# EAGLE schematic breakouts (EAGLE 6.5.0)
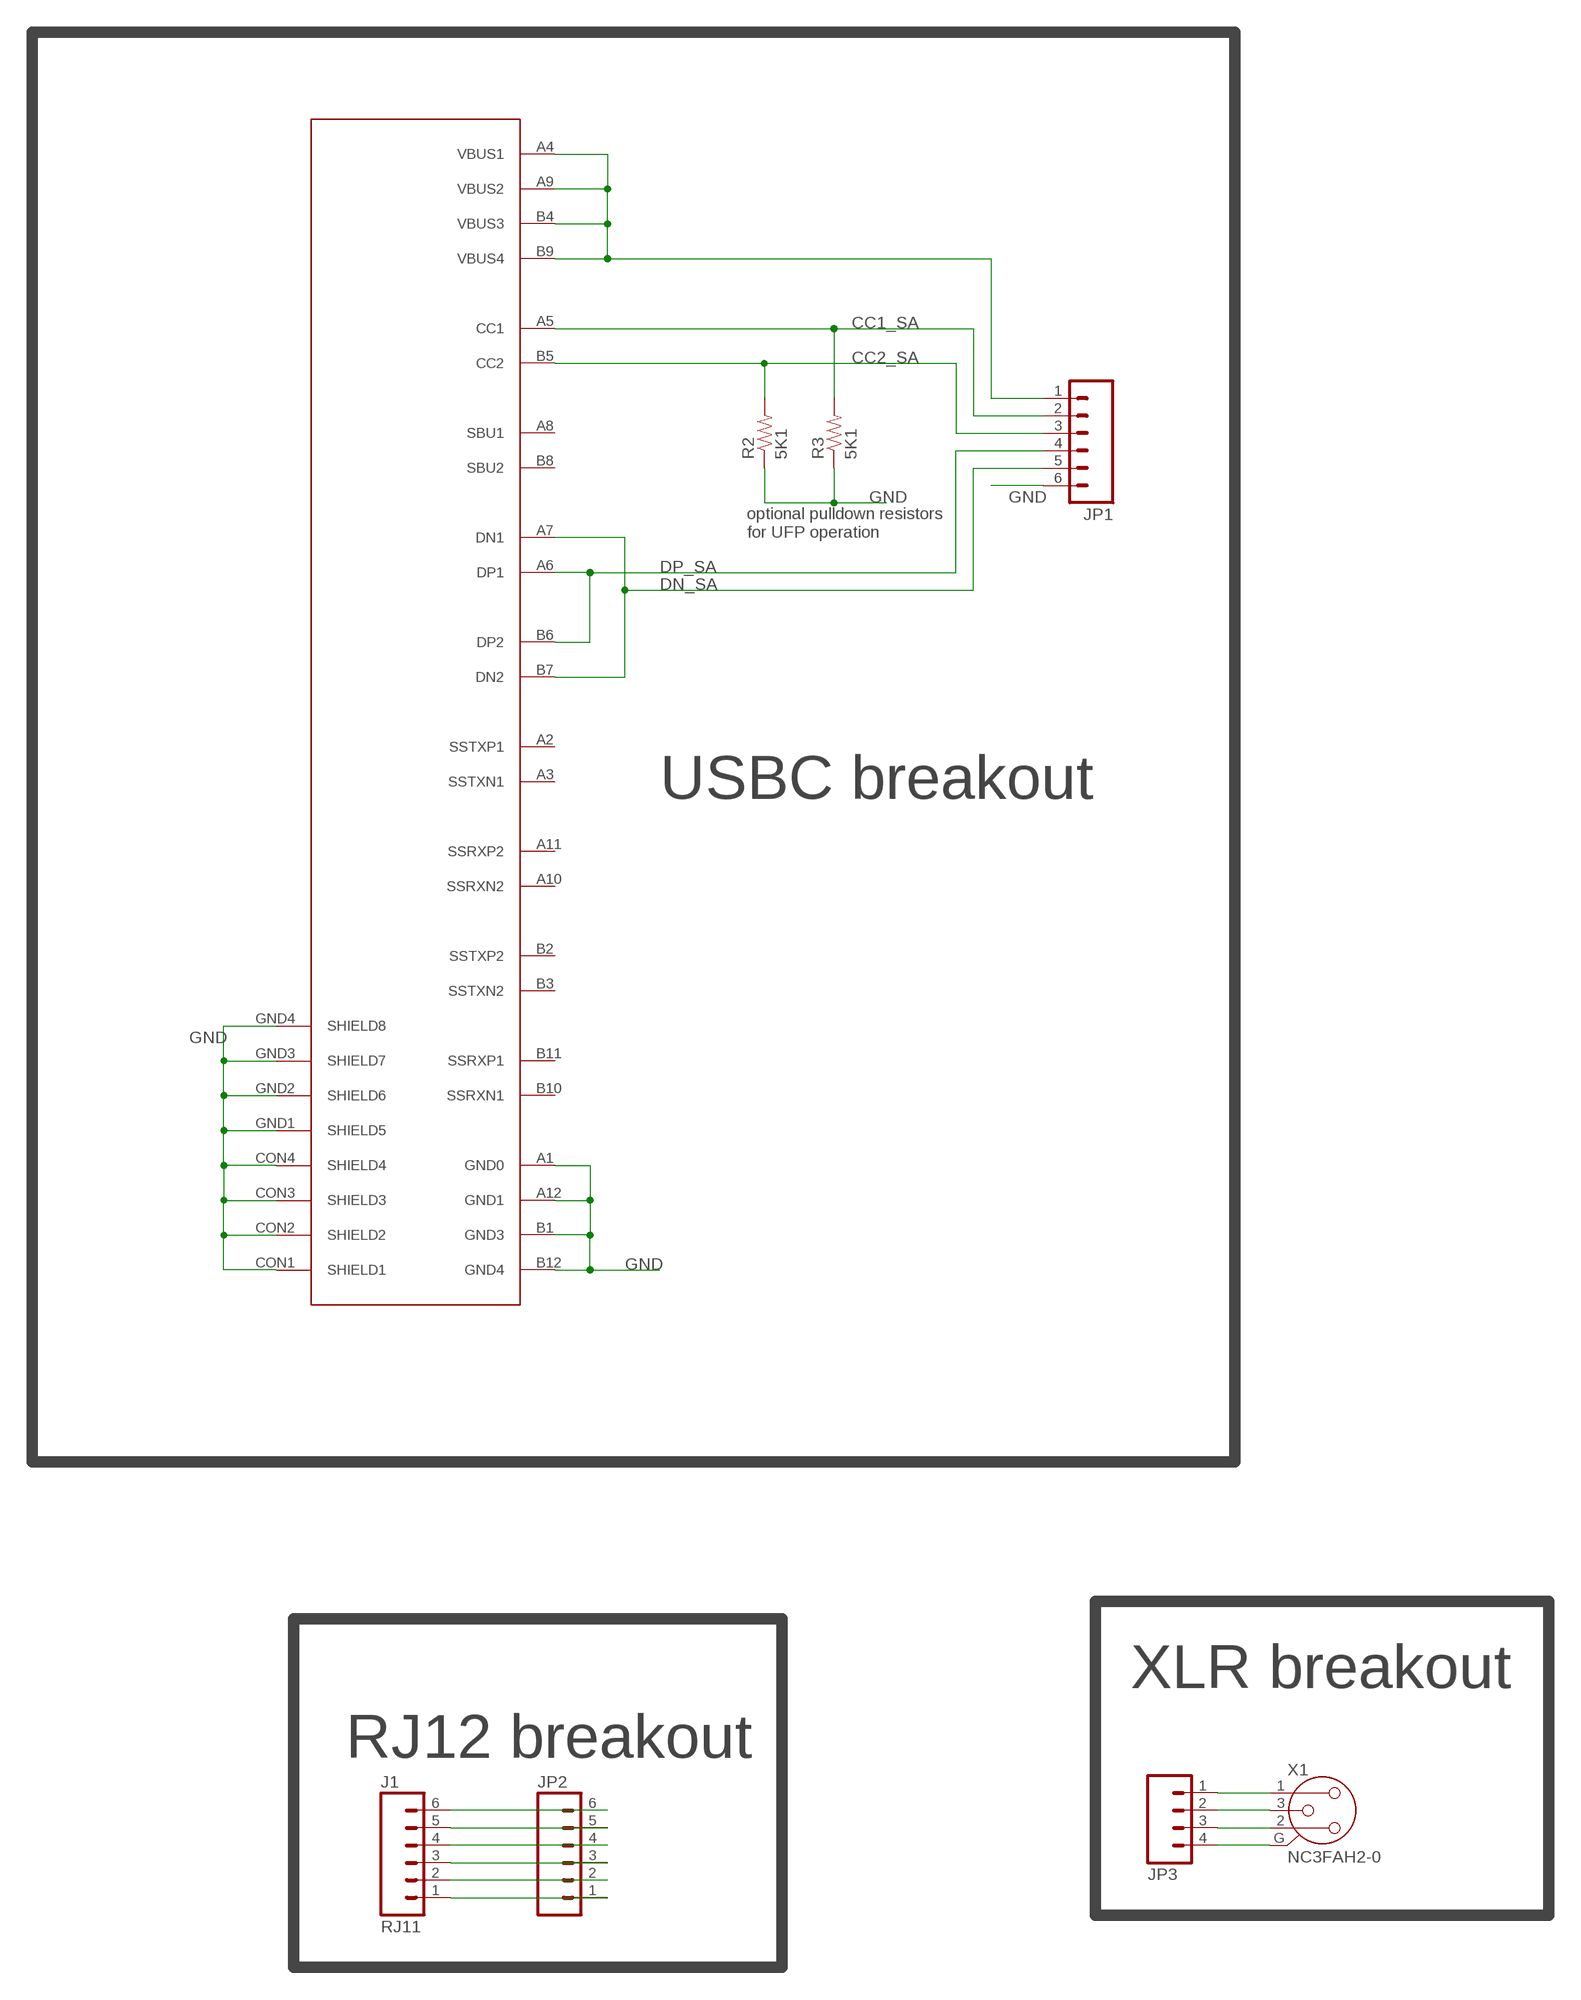
[diagram p0: schematic, sheet 1, part 1 of 2]
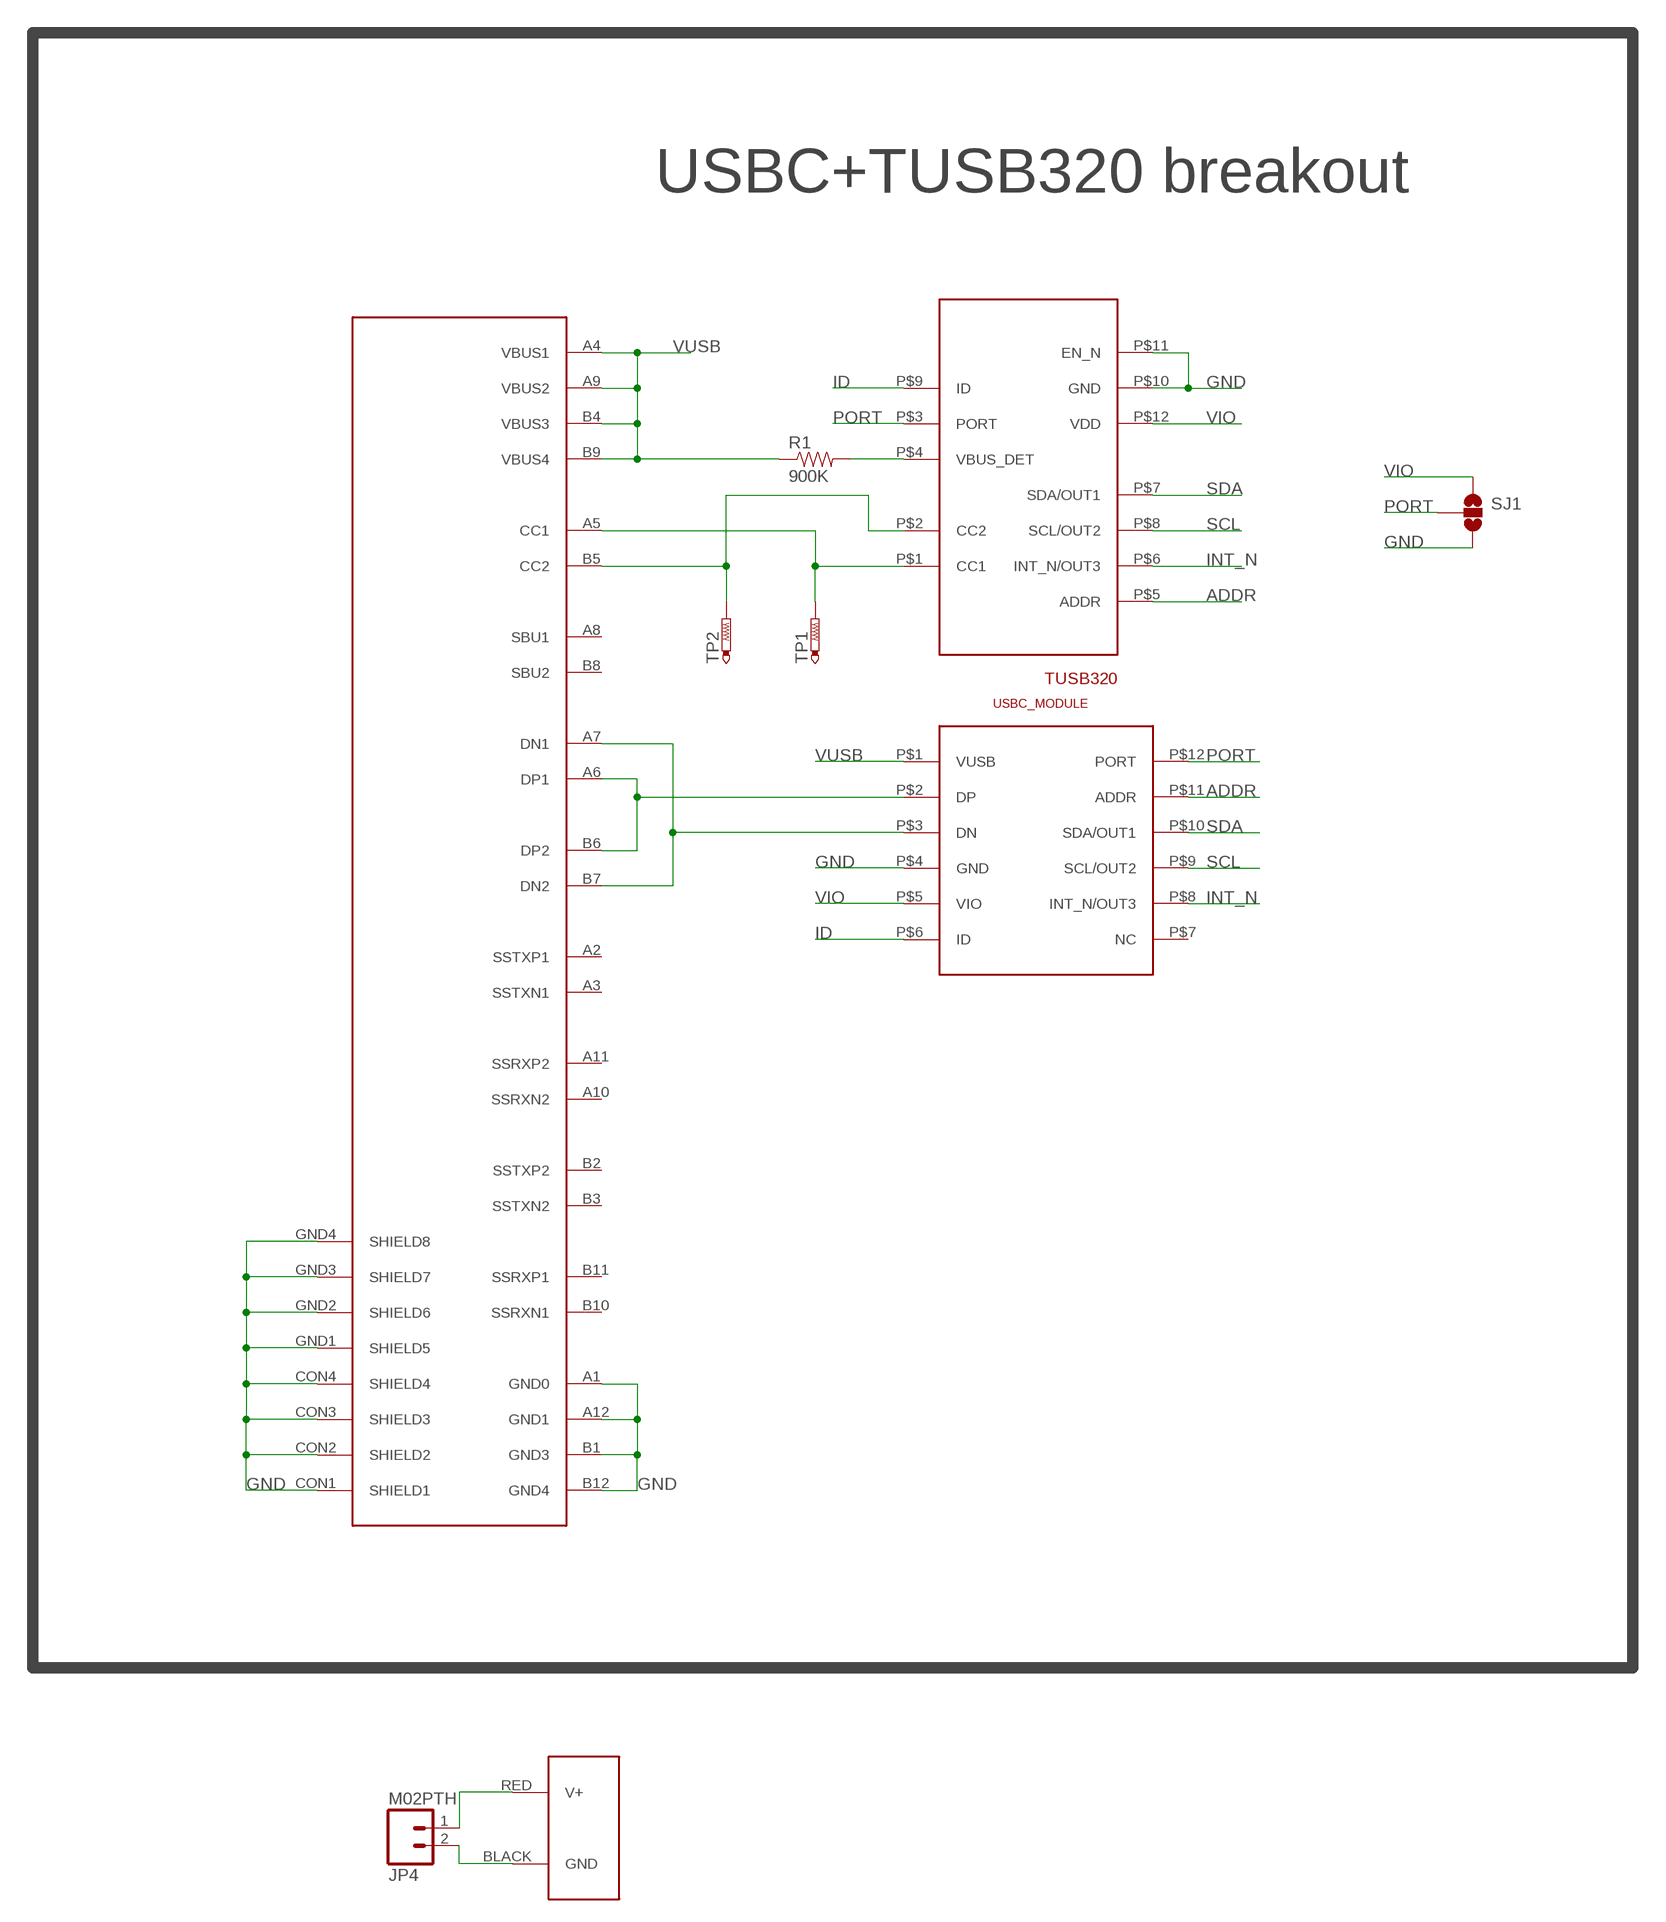
[diagram p1: schematic, sheet 1, part 2 of 2]

## Parts
CONN1  USB-C_WURTH_632723X00011USB-C  [USB-C_WURTH_632723X00011]
CONN2  USB-C_WURTH_632723X00011USB-C  [USB-C_WURTH_632723X00011]
J1  RJ11  RJ11-6PTH  [RJ11-6]
J2  POWERPOLE_POWER25A  [POWERPOLE_PAIR_25A]
JP1  M06SIP  [1X06]
JP2  M06SIP  [1X06]
JP3  M04PTH  [1X04]
JP4  M02PTH  [1X02]
R1  900K  RESISTOR0603-RES  [0603-RES]
R2  5K1  RESISTOR0603-RES  [0603-RES]
R3  5K1  RESISTOR0603-RES  [0603-RES]
SJ1  SOLDERJUMPER_2WAYS  [SJ_3]
TP1  PTR1TP10R  [TP10R]
TP2  PTR1TP10R  [TP10R]
U$1  TUSB320XQFN  [X2QFN]
U$2  USBC_BREAKOUTPDIP  [DIP12_6WIDE]
X1  NC3FAH2-0  [NC3FAH2-0]

## Nets
ADDR: U$1.P$5(ADDR) U$2.P$11(ADDR)
CC1: CONN1.A5(CC1) TP1.TP U$1.P$1(CC1)
CC1_SA: CONN2.A5(CC1) JP1.2 R3.2
CC2: CONN1.B5(CC2) TP2.TP U$1.P$2(CC2)
CC2_SA: CONN2.B5(CC2) JP1.3 R2.2
DN: CONN1.A7(DN1) CONN1.B7(DN2) U$2.P$3(DN)
DN_SA: CONN2.A7(DN1) CONN2.B7(DN2) JP1.5
DP: CONN1.A6(DP1) CONN1.B6(DP2) U$2.P$2(DP)
DP_SA: CONN2.A6(DP1) CONN2.B6(DP2) JP1.4
GND: CONN1.A1(GND0) CONN1.A12(GND1) CONN1.B1(GND3) CONN1.B12(GND4) CONN1.CON1(SHIELD1) CONN1.CON2(SHIELD2) CONN1.CON3(SHIELD3) CONN1.CON4(SHIELD4) CONN1.GND1(SHIELD5) CONN1.GND2(SHIELD6) CONN1.GND3(SHIELD7) CONN1.GND4(SHIELD8) CONN2.A1(GND0) CONN2.A12(GND1) CONN2.B1(GND3) CONN2.B12(GND4) CONN2.CON1(SHIELD1) CONN2.CON2(SHIELD2) CONN2.CON3(SHIELD3) CONN2.CON4(SHIELD4) CONN2.GND1(SHIELD5) CONN2.GND2(SHIELD6) CONN2.GND3(SHIELD7) CONN2.GND4(SHIELD8) JP1.6 R2.1 R3.1 SJ1.3 U$1.P$10(GND) U$1.P$11(EN_N) U$2.P$4(GND)
ID: U$1.P$9(ID) U$2.P$6(ID)
INT_N: U$1.P$6(INT_N/OUT3) U$2.P$8(INT_N/OUT3)
N$1: J1.1 JP2.1
N$2: J1.2 JP2.2
N$3: J1.3 JP2.3
N$4: J1.4 JP2.4
N$5: J1.5 JP2.5
N$6: J1.6 JP2.6
N$7: JP3.1 X1.1
N$8: JP3.2 X1.3
N$9: R1.2 U$1.P$4(VBUS_DET)
N$10: JP3.3 X1.2
N$11: JP3.4 X1.G
N$12: J2.RED(V+) JP4.1
N$13: J2.BLACK(GND) JP4.2
PORT: SJ1.2 U$1.P$3(PORT) U$2.P$12(PORT)
SCL: U$1.P$8(SCL/OUT2) U$2.P$9(SCL/OUT2)
SDA: U$1.P$7(SDA/OUT1) U$2.P$10(SDA/OUT1)
VBUS_SA: CONN2.A4(VBUS1) CONN2.A9(VBUS2) CONN2.B4(VBUS3) CONN2.B9(VBUS4) JP1.1
VIO: SJ1.1 U$1.P$12(VDD) U$2.P$5(VIO)
VUSB: CONN1.A4(VBUS1) CONN1.A9(VBUS2) CONN1.B4(VBUS3) CONN1.B9(VBUS4) R1.1 U$2.P$1(VUSB)
Unconnected: CONN1.A2(SSTXP1) CONN1.A3(SSTXN1) CONN1.A8(SBU1) CONN1.A10(SSRXN2) CONN1.A11(SSRXP2) CONN1.B2(SSTXP2) CONN1.B3(SSTXN2) CONN1.B8(SBU2) CONN1.B10(SSRXN1) CONN1.B11(SSRXP1) CONN2.A2(SSTXP1) CONN2.A3(SSTXN1) CONN2.A8(SBU1) CONN2.A10(SSRXN2) CONN2.A11(SSRXP2) CONN2.B2(SSTXP2) CONN2.B3(SSTXN2) CONN2.B8(SBU2) CONN2.B10(SSRXN1) CONN2.B11(SSRXP1) U$2.P$7(NC)

## Notes on the sheet
- USBC+TUSB320 breakout
- optional pulldown resistors
  for UFP operation
- USBC breakout
- XLR breakout
- RJ12 breakout

## Library data of the parts
CONN1 CONN2 = USB-C:USB-C_WURTH_632723X00011: Wurth USB C connector
J1 = SparkFun-Connectors:RJ11-6: RJ11 Jack Simple 6 pin RJ11 jack. Commonly found on CAT3 devices and Microchip programmers. SKU: PRT-00132; PROD_ID: CONN-08590
J2 = powerpoles:POWERPOLE_POWER: Anderson Powerpole Power Connector using ameteur radio standard layout
JP1 JP2 = SparkFun:M06: Header 6 Standard 6-pin 0.1" header. Use with straight break away headers (SKU : PRT-00116), right angle break away headers (PRT-00553), swiss pins (PRT-00743), machine pins (PRT-00117), and female headers (PRT-00115). Molex polarized connector foot print use with SKU : PRT-08094 with associated crimp pins and housings. NOTES ON THE VARIANTS LOCK and LOCK_LONGPADS... This footprint was designed to help hold the alignment of a through-hole component (i.e. 6-pin header) while soldering it into place. You may notice that each hole has been shifted either up or down by 0.005 of an inch from it's more standard position (which is a perfectly straight line). This slight alteration caused the pins (the squares in the middle) to touch the edges of the holes. Because they are alternating, it causes a "brace" to hold the component in place. 0.005 has proven to be the perfect amount of "off-center" position when using our standard breakaway headers. Although looks a little odd when you look at the bare footprint, once you have a header in there, the alteration is very hard to notice. Also, if you push a header all the way into place, it is covered up entirely on the bottom side. This idea of altering the position of holes to aid alignment will be further integrated into the Sparkfun Library for other footprints. It can help hold any component with 3 or more connection pins.
JP3 = SparkFun-Connectors:M04: Header 4 Standard 4-pin 0.1" header. Use with straight break away headers (SKU : PRT-00116), right angle break away headers (PRT-00553), swiss pins (PRT-00743), machine pins (PRT-00117), and female headers (PRT-00115). Molex polarized connector foot print use with SKU : PRT-08231 with associated crimp pins and housings. 1MM SMD Version SKU: PRT-10208
JP4 = SparkFun-Connectors:M02: Standard 2-pin 0.1" header. Use with - straight break away headers ( PRT-00116) - right angle break away headers (PRT-00553) - swiss pins (PRT-00743) - machine pins (PRT-00117) - female headers (PRT-00115) Molex polarized connector foot print use with: PRT-08233 with associated crimp pins and housings. 2.54_SCREWTERM for use with PRT-10571. 3.5mm Screw Terminal footprints for PRT-08084 5mm Screw Terminal footprints for use with PRT-08432
R1-R3 = SparkFun-Passives:RESISTOR: Resistor Basic schematic elements and footprints for 0603, 1206, and PTH resistors.
SJ1 = SparkFun:SOLDERJUMPER_2WAY: Solder Jumper 2 way solder jumper
TP1 TP2 = testpad:PTR1: TEST PIN
U$1 = USB-C:TUSB320: TUSB320 USB Type-C Configuration Channel Logic and Port Control
U$2 = USB-C:USBC_BREAKOUT: USB Type-C brekout module with TUSB320 Controler
X1 = con-neutrik_ag:NC3: Neutrik Audio Connector XLR SERIES Stereo 1/4" jack Source: www.neutrik.com/; MPN: NC3FAH-2-0; OC_FARNELL: unknown; OC_NEWARK: 11J5829